# Altium project Motor Controller V2.PrjPCB
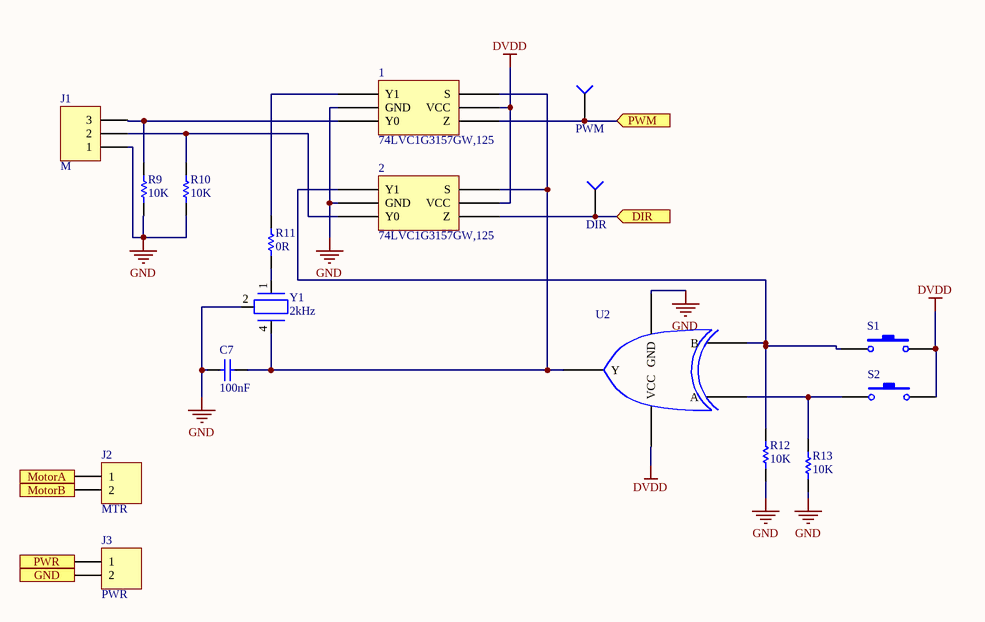
[diagram p0: MC_Sch2.SchDoc]
2 sheets, 44 parts. Net scope: flat (ports and power ports of the same name join across sheets).
Board file: MC_PCB.PcbDoc
Sheets:
  MC_Sch2.SchDoc
  MCMainSch.SchDoc

## Sheet MC_Sch2.SchDoc
size A4

### Parts
1  74LVC1G3157GW,125  [IC MUX/DEMUX]
2  74LVC1G3157GW,125  [IC MUX/DEMUX]
C7  value 100nF  [CAPC0603(1608)55_N]  (hidden comment: CAP_10nF_0603)
J1  M  [HDR1X3]
J2  MTR  [OSTYK51102030]
J3  PWR  [OSTYK51102030]
R9  value 10K  [RESC0603(1608)_N]  (hidden comment: RES_10K_0603)
R10  value 10K  [RESC0603(1608)_N]  (hidden comment: RES_10K_0603)
R11  value 0R  [RESC0603(1608)_N]  (hidden comment: RES_0R_0603)
R12  value 10K  [RESC0603(1608)_N]  (hidden comment: RES_10K_0603)
R13  value 10K  [RESC0603(1608)_N]  (hidden comment: RES_10K_0603)
S1  SW_PWR  [PTS830GM140]  (value not drawn)
S2  SW_PWR  [PTS830GM140]  (value not drawn)
TP5  PWM  [TESTPOINT_LOOP]
TP6  DIR  [TESTPOINT_LOOP]
U2  SN74AHC1G02DBVT  [SOT23-5]  (value not drawn)
Y1  2kHz  [CDFN-4]

### Ports
DIR (in), GND (in), MotorA (in), MotorB (in), PWM (in), PWR (in)

### Nets
DVDD: 1.5(VCC) 2.5(VCC) S1.2 S2.2 U2.5(VCC)
GND: 1.2(GND) 2.2(GND) C7.2 J1.1 J3.2 R9.1 R10.1 R12.1 R13.1 U2.3(GND) Y1.2(GND) ; port GND
Net1_1: 1.1(Y1) R11.2
Net1_3: 1.3(Y0) J1.3 R9.2
Net1_4: 1.4(Z) TP5.1(=value) ; port PWM
Net1_6: 1.6(S) 2.6(S) C7.1 U2.4(Y) Y1.4(VDD)
Net2_1: 2.1(Y1) R12.2 S1.1 U2.2(B)
Net2_3: 2.3(Y0) J1.2 R10.2
Net2_4: 2.4(Z) TP6.1(=value) ; port DIR
NetD1_2: J3.1 ; port PWR
NetJ2_1: J2.1 ; port MotorA
NetJ2_2: J2.2 ; port MotorB
NetR11_1: R11.1 Y1.1(OUT)
NetR13_2: R13.2 S2.1 U2.1(A)

### Library data of the parts
1 2 = IC MUX/DEMUX 2x1: Manufacturer: NXP Semiconductors; Min Supply Voltage: 1.65V; Max Supply Voltage: 5.5V; Number of Channels: 1; Bandwidth: 300MHz; Propagation Delay: 1ns; Max Power Dissipation: 250mW; On-State Resistance: 15R; Turn-On Delay Time: 8.7ns; Turn-Off Delay Time: 6ns; Operating Supply Current: 40uA; Number of Inputs: 2; Logic Function: Demultiplexer,Demux,Multiplexer,Mux; Supply Type: Single; Supplier 1: Digi-Key; Manufacturer Part Number: 74LVC1G3157GW,125; Stock 1: 109219; Pricing 1: 1=0.37, 10=0.276, 100=0.156, 500=0.10332, 1000=0.07921 (USD); Mount: Surface Mount; Case/Package: TSSOP; Number of Pins: 6; Min Operating Temperature: -40°C; Max Operating Temperature: 125°C; Packaging: Tape and Reel; Package Quantity: 3000; Number of Outputs: 1; Power Dissipation: 250mW; Number of Circuits: 1; Radiation Hardening: No; Lead Free: Lead Free; REACH SVHC: No SVHC; ComponentLink1URL: http://www.nxp.com/documents/data_sheet/74LVC1G3157.pdf?src-supplier=Avnet; ComponentLink1Description: http://www.nxp.com/documents/data_sheet/74LVC1G3157.pdf?src-supplier=Avnet; ComponentLink2URL: https://www.verical.com/server-webapp/html/getDatasheet?partID=347929&src-supplier=Verical; ComponentLink2Description: https://www.verical.com/server-webapp/html/getDatasheet?partID=347929&src-supplier=Verical; ComponentLink3URL: http://www.nxp.com/documents/data_sheet/74LVC1G3157.pdf?src-supplier=Avnet+Asia; ComponentLink3Description: http://www.nxp.com/documents/data_sheet/74LVC1G3157.pdf?src-supplier=Avnet+Asia; ComponentLink4URL: http://www.nxp.com/documents/data_sheet/74LVC1G3157.pdf?src-supplier=Digi-Key; ComponentLink4Description: http://www.nxp.com/documents/data_sheet/74LVC1G3157.pdf?src-supplier=Digi-Key; ComponentLink5URL: http://www.nxp.com/documents/data_sheet/74LVC1G3157.pdf?src-supplier=Avnet+Europe; ComponentLink5Description: http://www.nxp.com/documents/data_sheet/74LVC1G3157.pdf?src-supplier=Avnet+Europe; Supplier Part Number 1: 1727-6073-6-ND
C7 = CAP_10nF_0603: CAP CER 10000PF 16V X7R 0603; MPN: CC0603KRX7R7BB103; Manufacturer: Yageo; Dimensions: 0.063" L x 0.031" W (1.60mm x 0.80mm); Package: 0603 (1608 Metric); Temperature Coefficient: X7R; Voltage Rating: 16V; Digikey Part Number: 311-3369-1-ND
J1 = Header 3: Header, 3-Pin; LatestRevisionDate: 17-Jul-2002; LatestRevisionNote: Re-released for DXP Platform.; Publisher: Altium Limited
J2 J3 = TERMINAL_2: Header, 2-Pin; LatestRevisionDate: 17-Jul-2002; LatestRevisionNote: Re-released for DXP Platform.; Publisher: Altium Limited
R9 R10 R12 R13 = RES_10K_0603: RES SMD 10K OHM 5% 1/10W 0603; Manufacturer: Yageo; MPN: RC0603JR-0710KL; Package: 0603 (1608 Metric); Dimensions: 0.063" L x 0.031" W (1.60mm x 0.80mm); Tolerance: 5%; Digikey Part Number: 311-10KGRCT-ND
R11 = RES_0R_0603: RES SMD 0 OHM JUMPER 1/10W 0603; Manufacturer: Yageo; MPN: RC0603JR-070RL; Package: 0603 (1608 Metric); Dimensions: 0.063" L x 0.031" W (1.60mm x 0.80mm); Digikey Part Number: 311-0.0GRCT-ND
S1 S2 = SW_PWR: Power Switch (Red); pin to pad: 2>4; MPN: PTS830GM140 SMTR LFS; Manufacturer: C&K; ComponentLink1Description: Datasheet; ComponentLink1URL: https://www.ckswitches.com/media/1478/pts830.pdf; Digikey Part Number: CKN10587CT-ND
TP5 TP6 = *: TESTPOINT_SMD; Part Number (MPN): *
U2 = IC GATE XOR: Manufacturer: Texas Instruments; Max Supply Voltage: 5.5V; Min Supply Voltage: 2V; Logic Function: NOR; Quiescent Current: 1uA; Propagation Delay: 7.5ns; Number of Outputs: 1; Number of Inputs: 2; Low Level Output Current: 8mA; High Level Output Current: -8mA; Turn-On Delay Time: 8.5ns; Manufacturer Part Number: SN74AHC1G02DBVT; Mount: Surface Mount; Case/Package: SOT-23; Number of Pins: 5; Weight: 0.000557oz; Min Operating Temperature: -40°C; Max Operating Temperature: 125°C; Packaging: Tape and Reel; Package Quantity: 250; Number of Gates: 1; Number of Input Lines: 2; Number of Output Lines: 1; Number of Circuits: 1; Number of Elements: 1; Number of Bits: 1; Output Current: 8mA; Max Output Current: 8mA; Termination: SMD/SMT; Radiation Hardening: No; Lead Free: Lead Free; REACH SVHC: No SVHC; ComponentLink1URL: http://www.ti.com/lit/ds/symlink/sn74ahc1g02.pdf?src-supplier=Digi-Key; ComponentLink1Description: http://www.ti.com/lit/ds/symlink/sn74ahc1g02.pdf?src-supplier=Digi-Key; ComponentLink2URL: http://focus.ti.com/lit/ds/symlink/sn74ahc1g02.pdf?src-supplier=Avnet+Europe; ComponentLink2Description: http://focus.ti.com/lit/ds/symlink/sn74ahc1g02.pdf?src-supplier=Avnet+Europe; ComponentLink3URL: http://www.farnell.com/datasheets/1786933.pdf?src-supplier=Element14; ComponentLink3Description: http://www.farnell.com/datasheets/1786933.pdf?src-supplier=Element14; Supplier 1: Digi-Key; Supplier Part Number 1: 296-1094-1-ND
Y1 = OSC_2kHz: OSCILLATOR_2kHz; Supplier 1: Digi-Key; Supplier Part Number 1: DSC6083CI2A-002K000-ND

## Sheet MCMainSch.SchDoc
size A
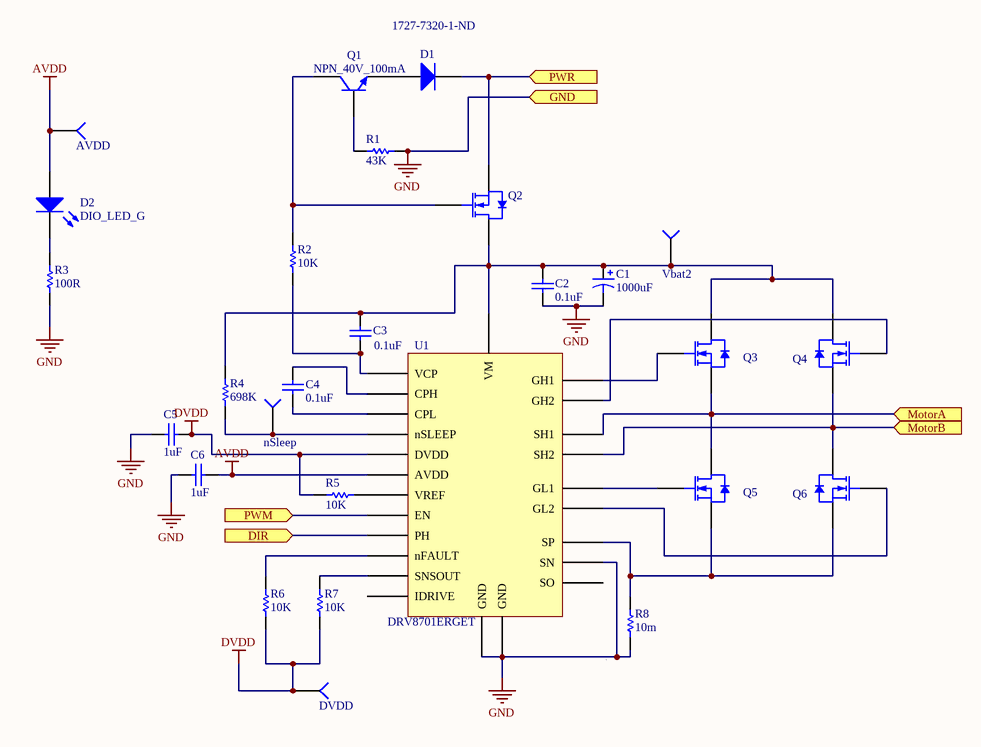
[diagram p1: MCMainSch.SchDoc]

### Parts
C1  value 1000uF  [CAPR-2/4h6.8]  (hidden comment: CAP_22uF_POL)
C2  value 0.1uF  [CAPC0603(1608)55_N]  (hidden comment: CAP_0.1uF_16V_0603)
C3  value 0.1uF  [CAPC0603(1608)55_N]  (hidden comment: CAP_0.1uF_16V_0603)
C4  value 0.1uF  [CAPC0603(1608)55_N]  (hidden comment: CAP_0.1uF_16V_0603)
C5  value 1uF  [CAPC0603(1608)55_N]  (hidden comment: CAP_1uF_16V_0603)
C6  value 1uF  [CAPC0603(1608)55_N]  (hidden comment: CAP_1uF_16V_0603)
D1  Supplier Part Number 1: 1727-7320-1-ND  [DIODSOD-123]  (hidden comment: 0)
D2  DIO_LED_G  [LED_0805_LINE]
Q1  NPN_40V_100mA  [SOT23-3]
Q2  NMOS_40V_75A  [SOT404]  (value not drawn)
Q3  NMOS_40V_75A  [SOT404]  (value not drawn)
Q4  NMOS_40V_75A  [SOT404]  (value not drawn)
Q5  NMOS_40V_75A  [SOT404]  (value not drawn)
Q6  NMOS_40V_75A  [SOT404]  (value not drawn)
R1  value 43K  [RESC0603(1608)_N]  (hidden comment: RES_43K_0603)
R2  value 10K  [RESC0603(1608)_N]  (hidden comment: RES_10K_0603)
R3  value 100R  [RESC0603(1608)_N]  (hidden comment: RES_0R_0603)
R4  value 698K  [RESC0603(1608)_N]  (hidden comment: RES_698K_0603)
R5  value 10K  [RESC0603(1608)_N]  (hidden comment: RES_10K_0603)
R6  value 10K  [RESC0603(1608)_N]  (hidden comment: RES_10K_0603)
R7  value 10K  [RESC0603(1608)_N]  (hidden comment: RES_10K_0603)
R8  value 10m  [STAC-CSS2725-099H_V]  (hidden comment: RES_10m_2728)
TP1  AVDD  [TESTPOINT]
TP2  Vbat2  [TESTPOINT]
TP3  nSleep  [TESTPOINT]
TP4  DVDD  [TESTPOINT]
U1  DRV8701ERGET  [VFQFPN-24_N]

### Ports
DIR (in), GND (in), MotorA (in), MotorB (in), PWM (in), PWR (in)

### Nets
AVDD: C6.2 D2.1(A) TP1.1(=value) U1.6(AVDD)
DVDD: C5.2 R5.1 R6.1 R7.1 TP4.1(=value) U1.5(DVDD)
GND: C1.2 C2.1 C5.1 C6.1 R1.1 R3.1 R8.1 U1.13(GND) U1.14(GND) U1.22(SN) ; port GND
Net1_4: U1.8(EN) ; port PWM
Net2_4: U1.9(PH) ; port DIR
NetC1_1: C1.1 C2.2 C3.2 Q2.4(D) Q3.4(D) Q4.4(D) R4.2 TP2.1(=value) U1.24(VM)
NetC3_1: C3.1 R2.1 U1.1(VCP)
NetC4_1: C4.1 U1.3(CPL)
NetC4_2: C4.2 U1.2(CPH)
NetD1_1: D1.1(A) Q1.2(E)
NetD1_2: D1.2(K) Q2.3(S) ; port PWR
NetD2_2: D2.2(K) R3.2
NetJ2_1: Q3.3(S) Q5.4(D) U1.17(SH1) ; port MotorA
NetJ2_2: Q4.3(S) Q6.4(D) U1.18(SH2) ; port MotorB
NetQ1_1: Q1.1(B) R1.2
NetQ1_3: Q1.3(C) Q2.1(G) R2.2
NetQ3_1: Q3.1(G) U1.15(GH1)
NetQ4_1: Q4.1(G) U1.16(GH2)
NetQ5_1: Q5.1(G) U1.19(GL1)
NetQ5_3: Q5.3(S) Q6.3(S) R8.2 U1.21(SP)
NetQ6_1: Q6.1(G) U1.20(GL2)
NetR4_1: R4.1 TP3.1(=value) U1.4(nSLEEP)
NetR5_2: R5.2 U1.7(VREF)
NetR6_2: R6.2 U1.10(nFAULT)
NetR7_2: R7.2 U1.11(SNSOUT)

Not connected (* = marked no-connect by the designer): U1 12(IDRIVE) 23(SO) 25(GND)

### Library data of the parts
C1 = CAP_22uF_POL: CAP ALUM 22UF 20% 50V RADIAL; Manufacturer: Wurth Electronics Inc.; MPN: 860020672011; Voltage Rating: 50V; Tolerance: 20%; Digikey Part Number: 732-8857-1-ND
C2-C4 = CAP_0.1uF_16V_0603: CAP CER 0.1UF 16V X7R 0603; MPN: CC0603KRX7R7BB104; Manufacturer: Yageo; Dimensions: 0.063" L x 0.031" W (1.60mm x 0.80mm); Package: 0603 (1608 Metric); Temperature Coefficient: X7R; Voltage Rating: 16V; Digikey Part Number: 311-1088-1-ND
C5 C6 = CAP_1uF_16V_0603: CAP CER 1UF 16V Y5V 0603; MPN: CC0603ZRY5V7BB105; Manufacturer: Yageo; Dimensions: 0.063" L x 0.031" W (1.60mm x 0.80mm); Package: 0603 (1608 Metric); Temperature Coefficient: Y5V; Voltage Rating: 16V; Digikey Part Number: 311-1372-1-ND
D1 = DIO_BAS16GW: ESD PROTECTION DIODE; Manufacturer: Nexperia; Package: SOD-123; MPN: BAS16GW; ComponentLink1Description: Datasheet; ComponentLink1URL: https://assets.nexperia.com/documents/data-sheet/BAS16GW.pdf; Digikey Part Number: 1727-7320-1-ND; Supplier 1: Digi-Key
D2 = DIO_LED_G: LED GREEN DIFFUSED 0805 SMD; MPN: LG R971-KN-1; Manufacturer: OSRAM; Forward Voltage Drop: 2.2V; Package: 0805 (2012 Metric); Digikey Part Number: 475-1410-1-ND
Q1 = NPN_40V_100mA: TRANS NPN 40V 0.2A SOT23; Manufacturer: Micro Commercial Co; MPN: MMBT3904-TP; Package: TO-236-3, SC-59, SOT-23-3; ComponentLink1Description: Datasheet; ComponentLink1URL: http://www.mccsemi.com/up_pdf/MMBT3904(SOT-23).pdf; Digikey Part Number: MMBT3904TPMSCT-ND
Q2-Q6 = NMOS_40V_75A: MOSFET N-CH 40V 75A D2PAK; MPN: BUK768R1-40E,118; Manufacturer: Nexperia USA Inc.; Package: TO-263-3, D²Pak (2 Leads + Tab), TO-263AB; ComponentLink1Description: Datasheet; ComponentLink1URL: http://aosmd.com/res/data_sheets/AO3420.pdf; Digikey Part Number: 1727-7257-1-ND; Supplier 1: Digi-Key; Supplier Part Number 1: 1727-7255-1-ND
R1 = RES_43K_0603: RES SMD 43K OHM 5% 1/10W 0603; Manufacturer: Yageo; MPN: RC0603JR-0743KL; Package: 0603 (1608 Metric); Dimensions: 0.063" L x 0.031" W (1.60mm x 0.80mm); Tolerance: 5%; Digikey Part Number: 311-43KGRCT-ND
R2 R5-R7 = RES_10K_0603: as R9 on sheet MC_Sch2; Package: 0603 (1608 Metric); Dimensions: 0.063" L x 0.031" W (1.60mm x 0.80mm); Tolerance: 5%; Digikey Part Number: 311-10KGRCT-ND
R3 = RES_0R_0603: as R11 on sheet MC_Sch2; Package: 0603 (1608 Metric); Dimensions: 0.063" L x 0.031" W (1.60mm x 0.80mm); Digikey Part Number: 311-0.0GRCT-ND
R4 = RES_698K_0603: RES SMD 698K OHM 1% 1/10W 0603; Manufacturer: Yageo; MPN: RC0603FR-07698KL; Package: 0603 (1608 Metric); Dimensions: 0.063" L x 0.031" W (1.60mm x 0.80mm); Tolerance: 1%; Digikey Part Number: 311-698KHRCT-ND
R8 = RES_10m_2728: RES SMD 10mOHM 1% 4W 2728; Manufacturer: Yageo; MPN: RC0603FR-07698KL; Package: 0603 (1608 Metric); Dimensions: 0.063" L x 0.031" W (1.60mm x 0.80mm); Tolerance: 1%; Supplier 1: Digi-Key; Digikey Part Number: CSSH2728FT10L0DKR-ND
TP1-TP4 = *: TESTPOINT_SMD; Part Number (MPN): *
U1 = IC Motor Driver: Manufacturer: Texas Instruments; Interface: Parallel; Supplier 1: Digi-Key; Manufacturer Part Number: DRV8701ERGET; Stock 1: 17098; Pricing 1: 1=2.83, 10=2.541, 100=2.0425 (USD); Mount: Surface Mount; Case/Package: VQFN; Min Operating Temperature: -40°C; Max Operating Temperature: 125°C; Packaging: Tape and Reel; Lead Free: Lead Free; Supplier Part Number 1: 296-42155-1-ND

## Nets that join several sheets
DVDD: MC_Sch2 (5 pins), MCMainSch (6 pins)
GND: MC_Sch2 (11 pins), MCMainSch (10 pins)
Net1_4: MC_Sch2 (1.4 TP5.1), MCMainSch (U1.8)
Net2_4: MC_Sch2 (2.4 TP6.1), MCMainSch (U1.9)
NetD1_2: MC_Sch2 (J3.1), MCMainSch (D1.2 Q2.3)
NetJ2_1: MC_Sch2 (J2.1), MCMainSch (Q3.3 Q5.4 U1.17)
NetJ2_2: MC_Sch2 (J2.2), MCMainSch (Q4.3 Q6.4 U1.18)